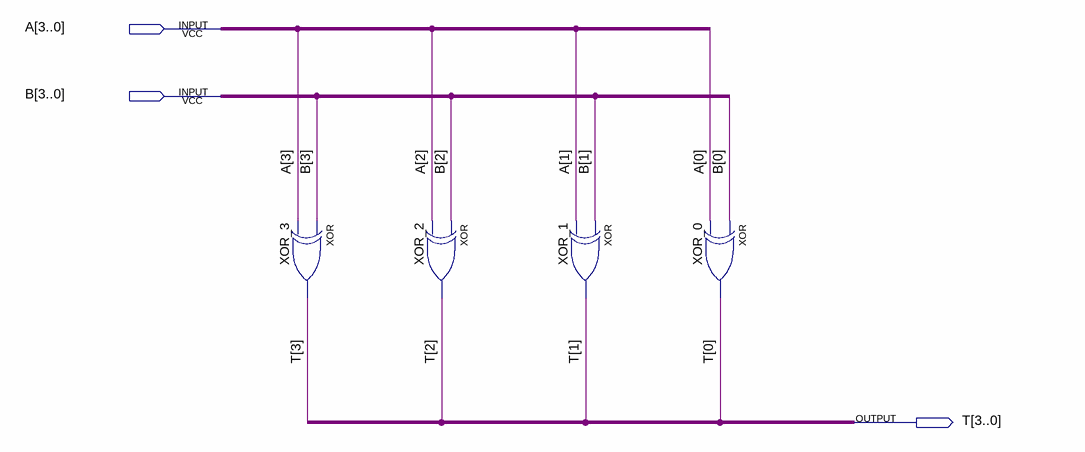
[diagram p0: schematic sheet]
// Quartus schematic XOR4bt.bdf as structural Verilog: 4 symbols, 3 pins
module XOR4bt (
  input  [3:0] A,
  input  [3:0] B,
  output [3:0] T
);

  xor XOR_3 (T[3], B[3], A[3]);
  xor XOR_2 (T[2], B[2], A[2]);
  xor XOR_1 (T[1], B[1], A[1]);
  xor XOR_0 (T[0], B[0], A[0]);
endmodule
